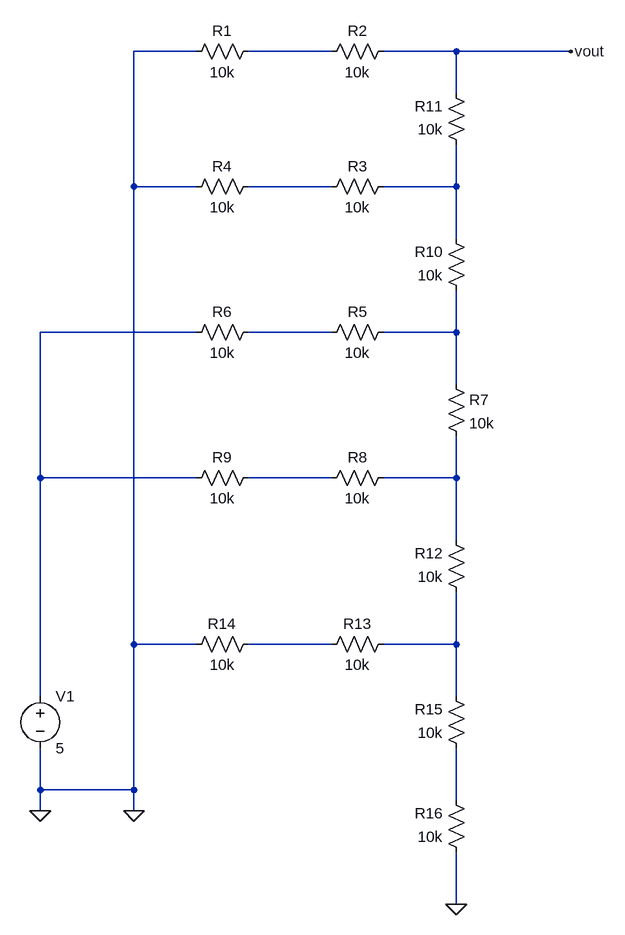
[diagram p0: schematic dac_ltspice_circuit.asc]
dac_ltspice_circuit.asc, the LTspice schematic file:
Version 4.1
SHEET 1 880 1364
WIRE -32 32 -128 32
WIRE 176 32 48 32
WIRE 368 32 256 32
WIRE 544 32 368 32
WIRE 368 96 368 32
WIRE -128 240 -128 32
WIRE -32 240 -128 240
WIRE 176 240 48 240
WIRE 368 240 368 176
WIRE 368 240 256 240
WIRE 368 320 368 240
WIRE -32 464 -272 464
WIRE 176 464 48 464
WIRE 368 464 368 400
WIRE 368 464 256 464
WIRE 368 544 368 464
WIRE -272 688 -272 464
WIRE -32 688 -272 688
WIRE 176 688 48 688
WIRE 368 688 368 624
WIRE 368 688 256 688
WIRE 368 784 368 688
WIRE -128 944 -128 240
WIRE -32 944 -128 944
WIRE 176 944 48 944
WIRE 368 944 368 864
WIRE 368 944 256 944
WIRE -272 1024 -272 688
WIRE 368 1024 368 944
WIRE -272 1168 -272 1104
WIRE -128 1168 -128 944
WIRE -128 1168 -272 1168
WIRE 368 1184 368 1104
WIRE -272 1200 -272 1168
WIRE -128 1200 -128 1168
WIRE 368 1344 368 1264
FLAG 368 1344 0
FLAG -272 1200 0
FLAG -128 1200 0
FLAG 544 32 vout
SYMBOL res 64 16 R90
WINDOW 0 0 56 VBottom 2
WINDOW 3 32 56 VTop 2
SYMATTR InstName R1
SYMATTR Value 10k
SYMBOL res 272 16 R90
WINDOW 0 0 56 VBottom 2
WINDOW 3 32 56 VTop 2
SYMATTR InstName R2
SYMATTR Value 10k
SYMBOL res 272 224 R90
WINDOW 0 0 56 VBottom 2
WINDOW 3 32 56 VTop 2
SYMATTR InstName R3
SYMATTR Value 10k
SYMBOL res 64 224 R90
WINDOW 0 0 56 VBottom 2
WINDOW 3 32 56 VTop 2
SYMATTR InstName R4
SYMATTR Value 10k
SYMBOL res 272 448 R90
WINDOW 0 0 56 VBottom 2
WINDOW 3 32 56 VTop 2
SYMATTR InstName R5
SYMATTR Value 10k
SYMBOL res 64 448 R90
WINDOW 0 0 56 VBottom 2
WINDOW 3 32 56 VTop 2
SYMATTR InstName R6
SYMATTR Value 10k
SYMBOL res 352 528 R0
SYMATTR InstName R7
SYMATTR Value 10k
SYMBOL res 272 672 R90
WINDOW 0 0 56 VBottom 2
WINDOW 3 32 56 VTop 2
SYMATTR InstName R8
SYMATTR Value 10k
SYMBOL res 64 672 R90
WINDOW 0 0 56 VBottom 2
WINDOW 3 32 56 VTop 2
SYMATTR InstName R9
SYMATTR Value 10k
SYMBOL res 384 416 R180
WINDOW 0 36 76 Left 2
WINDOW 3 36 40 Left 2
SYMATTR InstName R10
SYMATTR Value 10k
SYMBOL res 384 192 R180
WINDOW 0 36 76 Left 2
WINDOW 3 36 40 Left 2
SYMATTR InstName R11
SYMATTR Value 10k
SYMBOL res 384 880 R180
WINDOW 0 36 76 Left 2
WINDOW 3 36 40 Left 2
SYMATTR InstName R12
SYMATTR Value 10k
SYMBOL res 160 960 R270
WINDOW 0 32 56 VTop 2
WINDOW 3 0 56 VBottom 2
SYMATTR InstName R13
SYMATTR Value 10k
SYMBOL res 64 928 R90
WINDOW 0 0 56 VBottom 2
WINDOW 3 32 56 VTop 2
SYMATTR InstName R14
SYMATTR Value 10k
SYMBOL res 384 1120 R180
WINDOW 0 36 76 Left 2
WINDOW 3 36 40 Left 2
SYMATTR InstName R15
SYMATTR Value 10k
SYMBOL res 384 1280 R180
WINDOW 0 36 76 Left 2
WINDOW 3 36 40 Left 2
SYMATTR InstName R16
SYMATTR Value 10k
SYMBOL voltage -272 1008 R0
WINDOW 123 0 0 Left 0
WINDOW 39 0 0 Left 0
SYMATTR InstName V1
SYMATTR Value 5

The netlist it stands for:
* dac_ltspice_circuit.asc
R1 N001 0 10k
R2 vout N001 10k
R3 N003 N002 10k
R4 N002 0 10k
R5 N006 N005 10k
R6 N005 N004 10k
R7 N006 N008 10k
R8 N008 N007 10k
R9 N007 N004 10k
R10 N006 N003 10k
R11 N003 vout 10k
R12 N010 N008 10k
R13 N009 N010 10k
R14 N009 0 10k
R15 N011 N010 10k
R16 0 N011 10k
V1 N004 0 5
.backanno
.end